# Altium project PumpSystem.PrjPCB (part 8 of 8)

## Sheet [11] - EEPROM.SchDoc
size A3; DocumentNumber: 12; SheetNumber: 12; SheetTotal: 12
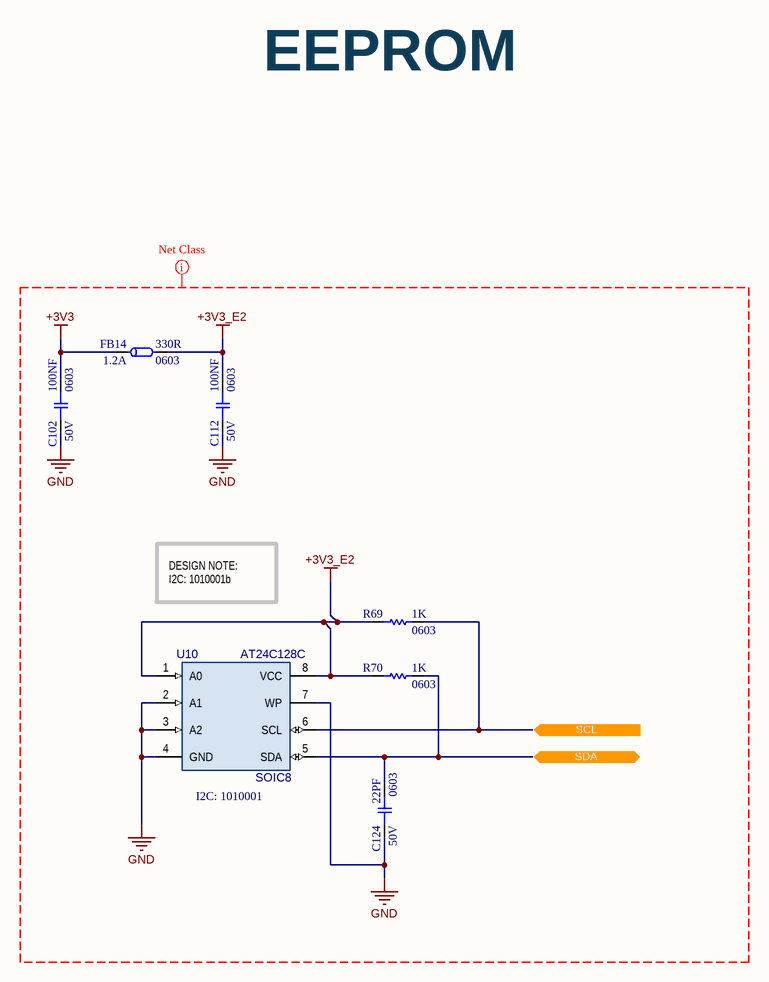
[diagram p11: [11] - EEPROM.SchDoc]

### Parts
C102  100NF  Voltage Rating: 50V  Case/Package: 0603  [C-0603]
C112  100NF  Voltage Rating: 50V  Case/Package: 0603  [C-0603]
C124  22PF  Voltage Rating: 50V  Case/Package: 0603  [C-0603]
FB14  330R  Case/Package: 0603  DC Current: 1.2A  [FB-0603]
R69  1K  Case Code (Imperial): 0603  [R-0603]
R70  1K  Case Code (Imperial): 0603  [R-0603]
U10  AT24C128C  [SOIC8]

### Ports
SCL (in), SDA (bidir)

### Nets
+3V3: C102.2 FB14.1
+3V3_E2: C112.2 FB14.2 R69.1 R70.1 U10.1(A0) U10.8(VCC)
GND: C102.1 C112.1 C124.1 U10.2(A1) U10.3(A2) U10.4(GND) U10.7(WP)
SCL: R69.2 U10.6(SCL) ; port SCL
SDA: C124.2 R70.2 U10.5(SDA) ; port SDA

### Layout directives
net class EEPROM: +3V3, +3V3_E2, GND

### Notes on the sheet
- EEPROM
- DESIGN NOTE:
  I2C: 1010001b
- (near U10) I2C: 1010001
- Date
- Name
- Product
- Variante:
- Editor
- Check
- Ref.
- Schematic
- File
- PCB-Number
- Rev.
- Description
- Sheet Size
- A3
- Sheet:
- /

### Library data of the parts
C102 C112 = C-100NF-0603: CAP CER 0.1UF 50V X7R 0603; Manufacturer: TDK; Manufacturer Part Number: C1608X7R1H104K080AA; Tolerance: 10%; Dielectric Material: Ceramic; .PCBCHK: CHECKED; .Creator: F:TALI; Temperature Coefficient: 30ppm/°C; Supplier 1: Digi-Key; Supplier Part Number 1: 445-1314-1-ND; Stock 1: 0; Pricing 1: 1=0.1, 10=0.057, 100=0.0254, 500=0.01812, 1000=0.01423 (USD); Mount: Surface Mount; Number of Pins: 2; Case Code (Metric): 1608; Case Code (Imperial): 0603; Min Operating Temperature: -55°C; Max Operating Temperature: 125°C; Capacitance: 100nF; Package Quantity: 1; Packaging: Tape and Reel; Voltage Rating (DC): 50V; Dielectric: X7R; Termination: SMD/SMT; Composition: Ceramic; Voltage: 50V; Length: 1.6mm; Height: 0.8mm; Width: 0.8mm; Thickness: 0.037inch; Depth: 0.8mm; Radiation Hardening: No; REACH SVHC: No SVHC; Lead Free: Lead Free; ComponentLink1URL: http://www.mouser.com/ds/2/400/lcc_commercial_general_en-837201.pdf; ComponentLink1Description: http://www.mouser.com/ds/2/400/lcc_commercial_general_en-837201.pdf; ComponentLink2URL: https://product.tdk.com/info/en/catalog/spec/mlccspec_commercial_general_midvoltage_en.pdf; ComponentLink2Description: https://product.tdk.com/info/en/catalog/spec/mlccspec_commercial_general_midvoltage_en.pdf; ComponentLink3URL: http://uk.rs-online.com/webdocs/13d1/0900766b813d1103.pdf; ComponentLink3Description: http://uk.rs-online.com/webdocs/13d1/0900766b813d1103.pdf; ComponentLink4URL: http://www.tdk.co.jp/tefe02/e412_c.pdf; ComponentLink4Description: http://www.tdk.co.jp/tefe02/e412_c.pdf; ComponentLink5URL: http://www.farnell.com/datasheets/2291921.pdf; ComponentLink5Description: http://www.farnell.com/datasheets/2291921.pdf; Supplier 2: Digi-Key; Supplier Part Number 2: 478-3540-6-ND; Stock 2: 40000; Pricing 2: 1=0.23, 10=0.161, 100=0.0756, 500=0.05304, 1000=0.0439 (USD); ComponentLink6URL: http://www.farnell.com/datasheets/1744655.pdf; ComponentLink6Description: http://www.farnell.com/datasheets/1744655.pdf; Contact Plating: Matte,Tin; ComponentLink7URL: http://catalogs.avx.com/SurfaceMount.pdf; ComponentLink7Description: http://catalogs.avx.com/SurfaceMount.pdf; ComponentLink8URL: http://www.farnell.com/datasheets/630895.pdf; ComponentLink8Description: http://www.farnell.com/datasheets/630895.pdf; ComponentLink9URL: http://www.avx.com/docs/Catalogs/cx7r.pdf; ComponentLink9Description: http://www.avx.com/docs/Catalogs/cx7r.pdf; .SCHCHK: CHECKED; Weight: 7.1E-05oz; Features: Soft Termination; ComponentLink10URL: http://www.avx.com/docs/catalogs/cauto.pdf; ComponentLink10Description: http://www.avx.com/docs/catalogs/cauto.pdf; ComponentLink11URL: https://www.verical.com/server-webapp/html/getDatasheet?partID=98691; ComponentLink11Description: https://www.verical.com/server-webapp/html/getDatasheet?partID=98691; ComponentLink12URL: https://www.avx.com/docs/Catalogs/flexiterm.pdf; ComponentLink12Description: https://www.avx.com/docs/Catalogs/flexiterm.pdf
C124 = C-22PF-0603: CAP CER 22PF 50V C0G/NP0 0603; Manufacturer: Samsung; Manufacturer Part Number: CL10C220JB8NNNC; Dielectric Material: Ceramic; Tolerance: 5%; Dielectric: C0G; .PCBCHK: USED; .Creator: F:TALI; Temperature Coefficient: 300ppm/°C; Insulation Resistance: 100GR; Washability: OK; Supplier 1: Digi-Key; Supplier Part Number 1: 1276-1023-6-ND; Stock 1: 0; Pricing 1: 1=0.1, 10=0.056, 100=0.0251, 500=0.0179, 1000=0.01406 (USD); Mount: Surface Mount; Number of Pins: 2; Case Code (Metric): 1608; Min Operating Temperature: -55°C; Max Operating Temperature: 125°C; Packaging: Tape and Reel; Package Quantity: 1; Voltage Rating (DC): 50V; Termination: SMD/SMT; Voltage: 50V; Length: 1.6mm; Height: 0.8mm; Width: 0.031inch; Thickness: 0.035inch; Depth: 0.8mm; Radiation Hardening: No; REACH SVHC: No SVHC; Lead Free: Lead Free; ComponentLink1URL: http://www1.futureelectronics.com/doc/SAMSUNG%20PASSIVE/CL05B104KQ5NNNC.pdf; ComponentLink1Description: http://www1.futureelectronics.com/doc/SAMSUNG%20PASSIVE/CL05B104KQ5NNNC.pdf; ComponentLink2URL: https://media.digikey.com/pdf/Data%20Sheets/Samsung%20PDFs/CL_Series_MLCC_ds.pdf; ComponentLink2Description: https://media.digikey.com/pdf/Data%20Sheets/Samsung%20PDFs/CL_Series_MLCC_ds.pdf; ComponentLink3URL: https://www.distrelec.biz/Web/Downloads/_e/ng/MLCC_CatalogDownload2013_ENG.pdf?mime=application%2Fpdf; ComponentLink3Description: https://www.distrelec.biz/Web/Downloads/_e/ng/MLCC_CatalogDownload2013_ENG.pdf?mime=application%2Fpdf; ComponentLink4URL: https://produktinfo.conrad.com/datenblaetter/450000-474999/457135-da-01-en-VS_KONDENSATOR_0603.pdf; ComponentLink4Description: https://produktinfo.conrad.com/datenblaetter/450000-474999/457135-da-01-en-VS_KONDENSATOR_0603.pdf; ComponentLink5URL: http://www.avx.com/docs/Catalogs/ccog.pdf; ComponentLink5Description: http://www.avx.com/docs/Catalogs/ccog.pdf; Capacitance: 22pF; Case Code (Imperial): 0603; Stock 2: 40000; Pricing 2: 1=0.1, 10=0.073, 100=0.0324, 500=0.02314, 1000=0.01818 (USD); Stock 3: 3383; Pricing 3: 1=0.1, 10=0.048, 100=0.0214, 500=0.01532, 1000=0.01203 (USD); ComponentLink6URL: https://www.verical.com/server-webapp/html/getDatasheet?partID=60906; ComponentLink6Description: https://www.verical.com/server-webapp/html/getDatasheet?partID=60906; .SCHCHK: USED; Material: Ceramic; Contact Plating: Tin; ComponentLink7URL: http://www.farnell.com/datasheets/759117.pdf; ComponentLink7Description: http://www.farnell.com/datasheets/759117.pdf; ComponentLink8URL: http://catalogs.avx.com/SurfaceMount.pdf; ComponentLink8Description: http://catalogs.avx.com/SurfaceMount.pdf; ComponentLink9URL: http://uk.rs-online.com/webdocs/140c/0900766b8140c8fe.pdf; ComponentLink9Description: http://uk.rs-online.com/webdocs/140c/0900766b8140c8fe.pdf; ComponentLink10URL: http://www1.futureelectronics.com/doc/SAMSUNG/CL10C220JB8NFNC.pdf; ComponentLink10Description: http://www1.futureelectronics.com/doc/SAMSUNG/CL10C220JB8NFNC.pdf; ComponentLink11URL: http://www.samsungsem.com/kr/support/product-search/mlcc/CL10C220JB8NFNC.jsp; ComponentLink11Description: http://www.samsungsem.com/kr/support/product-search/mlcc/CL10C220JB8NFNC.jsp
FB14 = FB-330R-0603: FERRITE BEAD 330 OHM 0603 1LN; Manufacturer: Murata; Manufacturer Part Number: BLM18PG331SN1D; Material: Steel,Ferrite; Tolerance: 25%; DC Resistance (DCR): 150mR; Number of Lines: 1; Test Frequency: 100MHz; Shielding: Unshielded; Supplier 1: Avnet; Stock 1: 132000; Pricing 1: 4000=0,01997, 8000=0,01922, 16000=0,01852, 24000=0,01785, 40000=0,01756 (USD); RoHS: Yes; Number of Pins: 2; Core Material: Ferrite; Case Code (Metric): 1608; Case Code (Imperial): 0603; Min Operating Temperature: -55°C; Max Operating Temperature: 125°C; Impedance: 330R; Package Quantity: 1; Packaging: Tape and Reel; Current Rating: 1.2A; Max Current Rating: 1.2A; Termination: SMD/SMT; Number of Circuits: 1; Length: 1.75mm; Height: 0.8mm; Width: 0.8mm; Depth: 0.95mm; Radiation Hardening: No; REACH SVHC: No SVHC; Lead Free: Lead Free; ComponentLink1URL: https://datasheet.ciiva.com/6211/enfa0003-6211710.pdf?src-supplier=Digi-Key; ComponentLink1Description: https://datasheet.ciiva.com/6211/enfa0003-6211710.pdf?src-supplier=Digi-Key; Supplier Part Number 1: BLM18PG331SN1D; Max DC Current: 1.2A
R69 R70 = R-1K-0603: RES SMD 1K OHM 5% 1/10W 0603; Manufacturer: Yageo; Manufacturer Part Number: RC0603JR-071KL; Resistance: 1kR; Temperature Coefficient: 100ppm/°C; Voltage Rating (DC): 50V; Power Rating: 100mW; Supplier 1: Digi-Key; Supplier Part Number 1: 311-1.0KGRCT-ND; Stock 1: 16415399; Pricing 1: 1=0.09, 10=0.019, 100=0.0077, 1000=0.00346, 2500=0.00301 (EUR); Case/Package: 0603; Number of Pins: 2; Contact Plating: Matte,Tin; Case Code (Metric): 1608; Min Operating Temperature: -55°C; Max Operating Temperature: 155°C; Tolerance: 5%; Composition: Thick Film; Packaging: Tape and Reel; Package Quantity: 5000; Voltage Rating: 50V; Termination: SMD/SMT; Military Standard: Not; Length: 1.6mm; Height: 0.45mm; Width: 0.8mm; Depth: 0.8mm; Radiation Hardening: No; REACH SVHC: Unknown; Lead Free: Lead Free; ComponentLink1URL: http://www.yageo.com/documents/recent/PYu-RC_Group_51_RoHS_L_2.pdf; ComponentLink1Description: http://www.yageo.com/documents/recent/PYu-RC_Group_51_RoHS_L_2.pdf; ComponentLink2URL: http://www.farnell.com/datasheets/443971.pdf; ComponentLink2Description: http://www.farnell.com/datasheets/443971.pdf; Supplier 2: Digi-Key; Supplier Part Number 2: YAG1311CT-ND; Stock 2: 9; Pricing 2: 1=0.1, 10=0.044, 100=0.0178, 1000=0.00798, 2500=0.00693 (USD); Number of Terminations: 2; Max Power Dissipation: 100mW; Features: Moisture Resistant; Supplier Part Number 3: SMD0603-1K; Stock 3: 0; Pricing 3: 100=0.0125, 1000=0.0035, 5000=0.002, 15000=0.00165, 50000=0.0014 (USD); Supplier 3: Ozdisan
U10 = IC-AT24C128C-SSHM-B: IC EEPROM 128K I2C 1MHZ 8SOIC; Manufacturer: Microchip / Atmel; Access Time: 900ns; Density: 128Kb; Interface: 2-Wire,I2C,Serial; Max Supply Voltage: 5.5V; Min Supply Voltage: 1.7V; Nominal Supply Current: 3mA; Number of Words: 16384; Supplier 1: Digi-Key; Manufacturer Part Number: AT24C128C-SSHM-B; Stock 1: 1826; Pricing 1: 1=0.45, 10=0.443, 25=0.4116, 100=0.3636 (USD); Mount: Surface Mount; Number of Pins: 8; Contact Plating: Matte,Tin; Min Operating Temperature: -40°C; Max Operating Temperature: 85°C; Max Frequency: 1MHz; Frequency: 1MHz; Packaging: Bulk; Package Quantity: 100; Memory Type: EEPROM; Memory Size: 128Kb; Length: 5.05mm; Height: 1.5mm; Width: 3.99mm; Radiation Hardening: No; REACH SVHC: No SVHC; ComponentLink1URL: https://www.verical.com/server-webapp/html/getDatasheet?partID=319282; ComponentLink1Description: https://www.verical.com/server-webapp/html/getDatasheet?partID=319282; ComponentLink2URL: http://www.microchip.com/mymicrochip/filehandler.aspx?ddocname=en589922; ComponentLink2Description: http://www.microchip.com/mymicrochip/filehandler.aspx?ddocname=en589922; ComponentLink3URL: http://www.farnell.com/datasheets/1726559.pdf; ComponentLink3Description: http://www.farnell.com/datasheets/1726559.pdf; Supplier Part Number 1: AT24C128C-SSHM-B-ND; Case/Package: SOIC8

## Nets that join several sheets
+3V3: [03] - MCU (C1.1 FB1.1), [04] - ETHERCAT (C18.1 FB2.1 R5.1 R61.1), [05] - PROFINET (C20.1 FB3.1 R8.1 R62.1), [06] - POWER (11 pins), [07] - RS232 (C51.1 FB5.1), [08] - IO-LINK (C58.1 FB6.1), [09] - AFE (C91.1 FB7.1), [10] - CONNECTORs (10 pins), [11] - EEPROM (C102.2 FB14.1)
+VIN: [06] - POWER (7 pins), [10] - CONNECTORs (J12.1)
+VIN_AVDD: [08] - IO-LINK (6 pins), [09] - AFE (C70.1 FB12.1 R18.1 U8.8), [10] - CONNECTORs (6 pins)
+VIN_EMI: [06] - POWER (8 pins), [09] - AFE (FB12.2)
CHASIS: [03] - MCU (MECH1.1 MECH2.1 MECH3.1 MECH4.1), [10] - CONNECTORs (12 pins)
GND: [03] - MCU (21 pins), [04] - ETHERCAT (18 pins), [05] - PROFINET (17 pins), [06] - POWER (35 pins), [07] - RS232 (6 pins), [08] - IO-LINK (14 pins), [09] - AFE (37 pins), [10] - CONNECTORs (90 pins), [11] - EEPROM (7 pins)
RTN: [06] - POWER (9 pins), [10] - CONNECTORs (J12.2)
CQ1: [08] - IO-LINK (D6.A TP36.1 U6.8), [10] - CONNECTORs (C101.1 J7.4 TVS9.A)
CQ2: [08] - IO-LINK (D7.A TP41.1 U?.8), [10] - CONNECTORs (C110.1 J9.4 TVS18.A)
ECAT_CM: [03] - MCU (U1.35), [04] - ETHERCAT (R65.2 SW1.1)
ECAT_RD1_N: [04] - ETHERCAT (MD1.13), [10] - CONNECTORs (T1.6 TVS31.2)
ECAT_RD1_P: [04] - ETHERCAT (MD1.14), [10] - CONNECTORs (T1.3 TVS31.1)
ECAT_RD2_N: [04] - ETHERCAT (MD1.20), [10] - CONNECTORs (T3.6 TVS35.2)
ECAT_RD2_P: [04] - ETHERCAT (MD1.19), [10] - CONNECTORs (T3.3 TVS35.1)
ECAT_RST: [03] - MCU (U1.36), [04] - ETHERCAT (6 pins)
ECAT_TD1_N: [04] - ETHERCAT (MD1.15), [10] - CONNECTORs (T1.2 TVS32.1)
ECAT_TD1_P: [04] - ETHERCAT (MD1.16), [10] - CONNECTORs (T1.1 TVS32.2)
ECAT_TD2_N: [04] - ETHERCAT (MD1.18), [10] - CONNECTORs (T3.2 TVS36.1)
ECAT_TD2_P: [04] - ETHERCAT (MD1.17), [10] - CONNECTORs (T3.1 TVS36.2)
IEXC1_RTD1: [09] - AFE (U9.4), [10] - CONNECTORs (C103.1 J5.1 TVS11.A)
IEXC1_RTD2: [09] - AFE (U9.7), [10] - CONNECTORs (C113.1 J5.5 TVS21.A)
IO1_RX: [03] - MCU (U1.16), [08] - IO-LINK (TP35.1 U6.3)
IO1_TX: [03] - MCU (U1.17), [08] - IO-LINK (Q2.1 TP38.1 U6.4)
IO2_RX: [03] - MCU (U1.14), [08] - IO-LINK (TP40.1 U?.3)
IO2_TX: [03] - MCU (U1.15), [08] - IO-LINK (Q3.1 TP42.1 U?.4)
IO_EN1: [03] - MCU (U1.33), [08] - IO-LINK (TP37.1 U6.5)
IO_EN2: [03] - MCU (U1.34), [08] - IO-LINK (TP43.1 U?.5)
IO_NFAULT1: [03] - MCU (U1.27), [08] - IO-LINK (C62.2 R14.2 U6.2)
IO_NFAULT2: [03] - MCU (U1.28), [08] - IO-LINK (C63.2 R16.2 U?.2)
JTCK: [03] - MCU (U1.49), [10] - CONNECTORs (J6.9)
JTDI: [03] - MCU (U1.50), [10] - CONNECTORs (J6.5)
JTDO: [03] - MCU (U1.55), [10] - CONNECTORs (J6.13)
JTMS: [03] - MCU (U1.46), [10] - CONNECTORs (J6.7)
LINKLED_IN: [04] - ETHERCAT (MD1.22), [10] - CONNECTORs (T1.10 T3.10)
LINKLED_OUT: [04] - ETHERCAT (MD1.11), [10] - CONNECTORs (T1.11 T3.11)
NJTRST: [03] - MCU (U1.56), [10] - CONNECTORs (J6.3)
NRST: [03] - MCU (C4.1 R1.2 U1.7), [10] - CONNECTORs (J6.15)
OSC_ST: [03] - MCU (U1.25), [09] - AFE (Y2.1)
PN3092_1: [09] - AFE (R59.1), [10] - CONNECTORs (C120.1 J7.2 TVS28.A)
PN3092_2: [09] - AFE (R60.1), [10] - CONNECTORs (C121.1 J9.2 TVS29.A)
PNET_CM: [03] - MCU (U1.44), [05] - PROFINET (R66.2 SW2.1)
PNET_LINKLED_IN: [05] - PROFINET (MD2.11), [10] - CONNECTORs (T2.10 T4.10)
PNET_LINKLED_OUT: [05] - PROFINET (MD2.22), [10] - CONNECTORs (T2.11 T4.11)
PNET_RD1_N: [05] - PROFINET (MD2.13), [10] - CONNECTORs (T2.6 TVS10.2)
PNET_RD1_P: [05] - PROFINET (MD2.14), [10] - CONNECTORs (T2.3 TVS10.1)
PNET_RD2_N: [05] - PROFINET (MD2.20), [10] - CONNECTORs (T4.6 TVS33.2)
PNET_RD2_P: [05] - PROFINET (MD2.19), [10] - CONNECTORs (T4.3 TVS33.1)
PNET_RST: [03] - MCU (U1.45), [05] - PROFINET (6 pins)
PNET_TD1_N: [05] - PROFINET (MD2.15), [10] - CONNECTORs (T2.2 TVS20.1)
PNET_TD1_P: [05] - PROFINET (MD2.16), [10] - CONNECTORs (T2.1 TVS20.2)
PNET_TD2_N: [05] - PROFINET (MD2.18), [10] - CONNECTORs (T4.2 TVS34.1)
PNET_TD2_P: [05] - PROFINET (MD2.17), [10] - CONNECTORs (T4.1 TVS34.2)
RS1_RX_MCU_TX: [03] - MCU (U1.51), [07] - RS232 (TP27.1 U5.11)
RS1_TX_MCU_RX: [03] - MCU (U1.52), [07] - RS232 (TP29.1 U5.12)
RS2_RX_MCU_TX: [03] - MCU (U1.53), [07] - RS232 (TP31.1 U5.10)
RS2_TX_MCU_RX: [03] - MCU (U1.54), [07] - RS232 (TP33.1 U5.9)
RS232_RXD1: [07] - RS232 (TP28.1 U5.14), [10] - CONNECTORs (R55.2 TVS3.1)
RS232_RXD2: [07] - RS232 (TP32.1 U5.7), [10] - CONNECTORs (R57.2 TVS6.1)
RS232_TXD1: [07] - RS232 (TP30.1 U5.13), [10] - CONNECTORs (R56.2 TVS3.2)
RS232_TXD2: [07] - RS232 (TP34.1 U5.8), [10] - CONNECTORs (R58.2 TVS6.2)
RTDN1: [09] - AFE (R26.1), [10] - CONNECTORs (C108.1 J5.3 TVS16.A)
RTDN2: [09] - AFE (R31.1), [10] - CONNECTORs (C117.1 J5.7 TVS25.A)
RTDP1: [09] - AFE (R19.1), [10] - CONNECTORs (C105.1 J5.2 TVS13.A)
RTDP2: [09] - AFE (R28.1), [10] - CONNECTORs (C115.1 J5.6 TVS23.A)
RXm_TX_PROFI: [03] - MCU (U1.38), [05] - PROFINET (J11.2 MD2.30 TP20.1)
RXm_TXe: [03] - MCU (U1.43), [04] - ETHERCAT (J10.2 MD1.30 TP13.1)
SCL: [03] - MCU (U1.41), [11] - EEPROM (R69.2 U10.6)
SDA: [03] - MCU (U1.40), [11] - EEPROM (C124.2 R70.2 U10.5)
SPI_CS: [03] - MCU (U1.20), [09] - AFE (TP55.1 U9.32)
SPI_MISO: [03] - MCU (U1.22), [09] - AFE (TP58.1 U9.28)
SPI_MOSI: [03] - MCU (U1.23), [09] - AFE (TP56.1 U9.29)
SPI_SCLK: [03] - MCU (U1.21), [09] - AFE (TP54.1 U9.30)
SYNC: [03] - MCU (U1.26), [09] - AFE (U9.27)
TXm_RX_PROFI: [03] - MCU (U1.37), [05] - PROFINET (J11.3 MD2.29 TP19.1)
TXm_RXe: [03] - MCU (U1.42), [04] - ETHERCAT (J10.3 MD1.29 TP14.1)
VREFP2: [09] - AFE (R39.1 TP8.1 U9.20), [10] - CONNECTORs (6 pins)
XP5_RTN: [09] - AFE (R34.1 R36.1), [10] - CONNECTORs (C118.1 J8.4 J8.8 TVS26.A)
XP5_VDRIVE: [09] - AFE (R30.2), [10] - CONNECTORs (C104.1 J8.1 J8.5 TVS12.A)
XP5N1: [09] - AFE (R38.1), [10] - CONNECTORs (C109.1 J8.3 TVS17.A)
XP5N2: [09] - AFE (R42.1), [10] - CONNECTORs (C116.1 J8.7 TVS24.A)
XP5P1: [09] - AFE (R37.1), [10] - CONNECTORs (C106.1 J8.2 TVS14.A)
XP5P2: [09] - AFE (R40.1), [10] - CONNECTORs (C114.1 J8.6 TVS22.A)

## Assembly variants
P10V: not fitted C79 C81 C82 R29 R32 R33 R34 R35 R36 R65 R66
P3V3: not fitted C66 C68 C70 C72 Q4 R18 R20 R21 R22 R23 R24 R25 R27 R65 R66 U8
Non-Pro: not fitted C95 C96 C97 C98 C99 C100 C101 C103 C104 C105 C106 C107 C108 C109 C110 C111 C113 C114 C115 C116 C117 C118 C119 C120 C121 J1 J2 J6 J10 J11 MD1 MD2 R5 R8 R20 R23 R30 R61 R62 TVS2 TVS4 TVS5 TVS7 TVS8 TVS9 TVS11 TVS12 TVS13 TVS14 TVS15 TVS16 TVS17 TVS18 TVS19 TVS21 TVS22 TVS23 TVS24 TVS25 TVS26 TVS27 TVS28 TVS29 TVS30 Y2